# Altium schematic sheet DRIVER.SchDoc
size A3; SheetNumber: 3; SheetTotal: 4
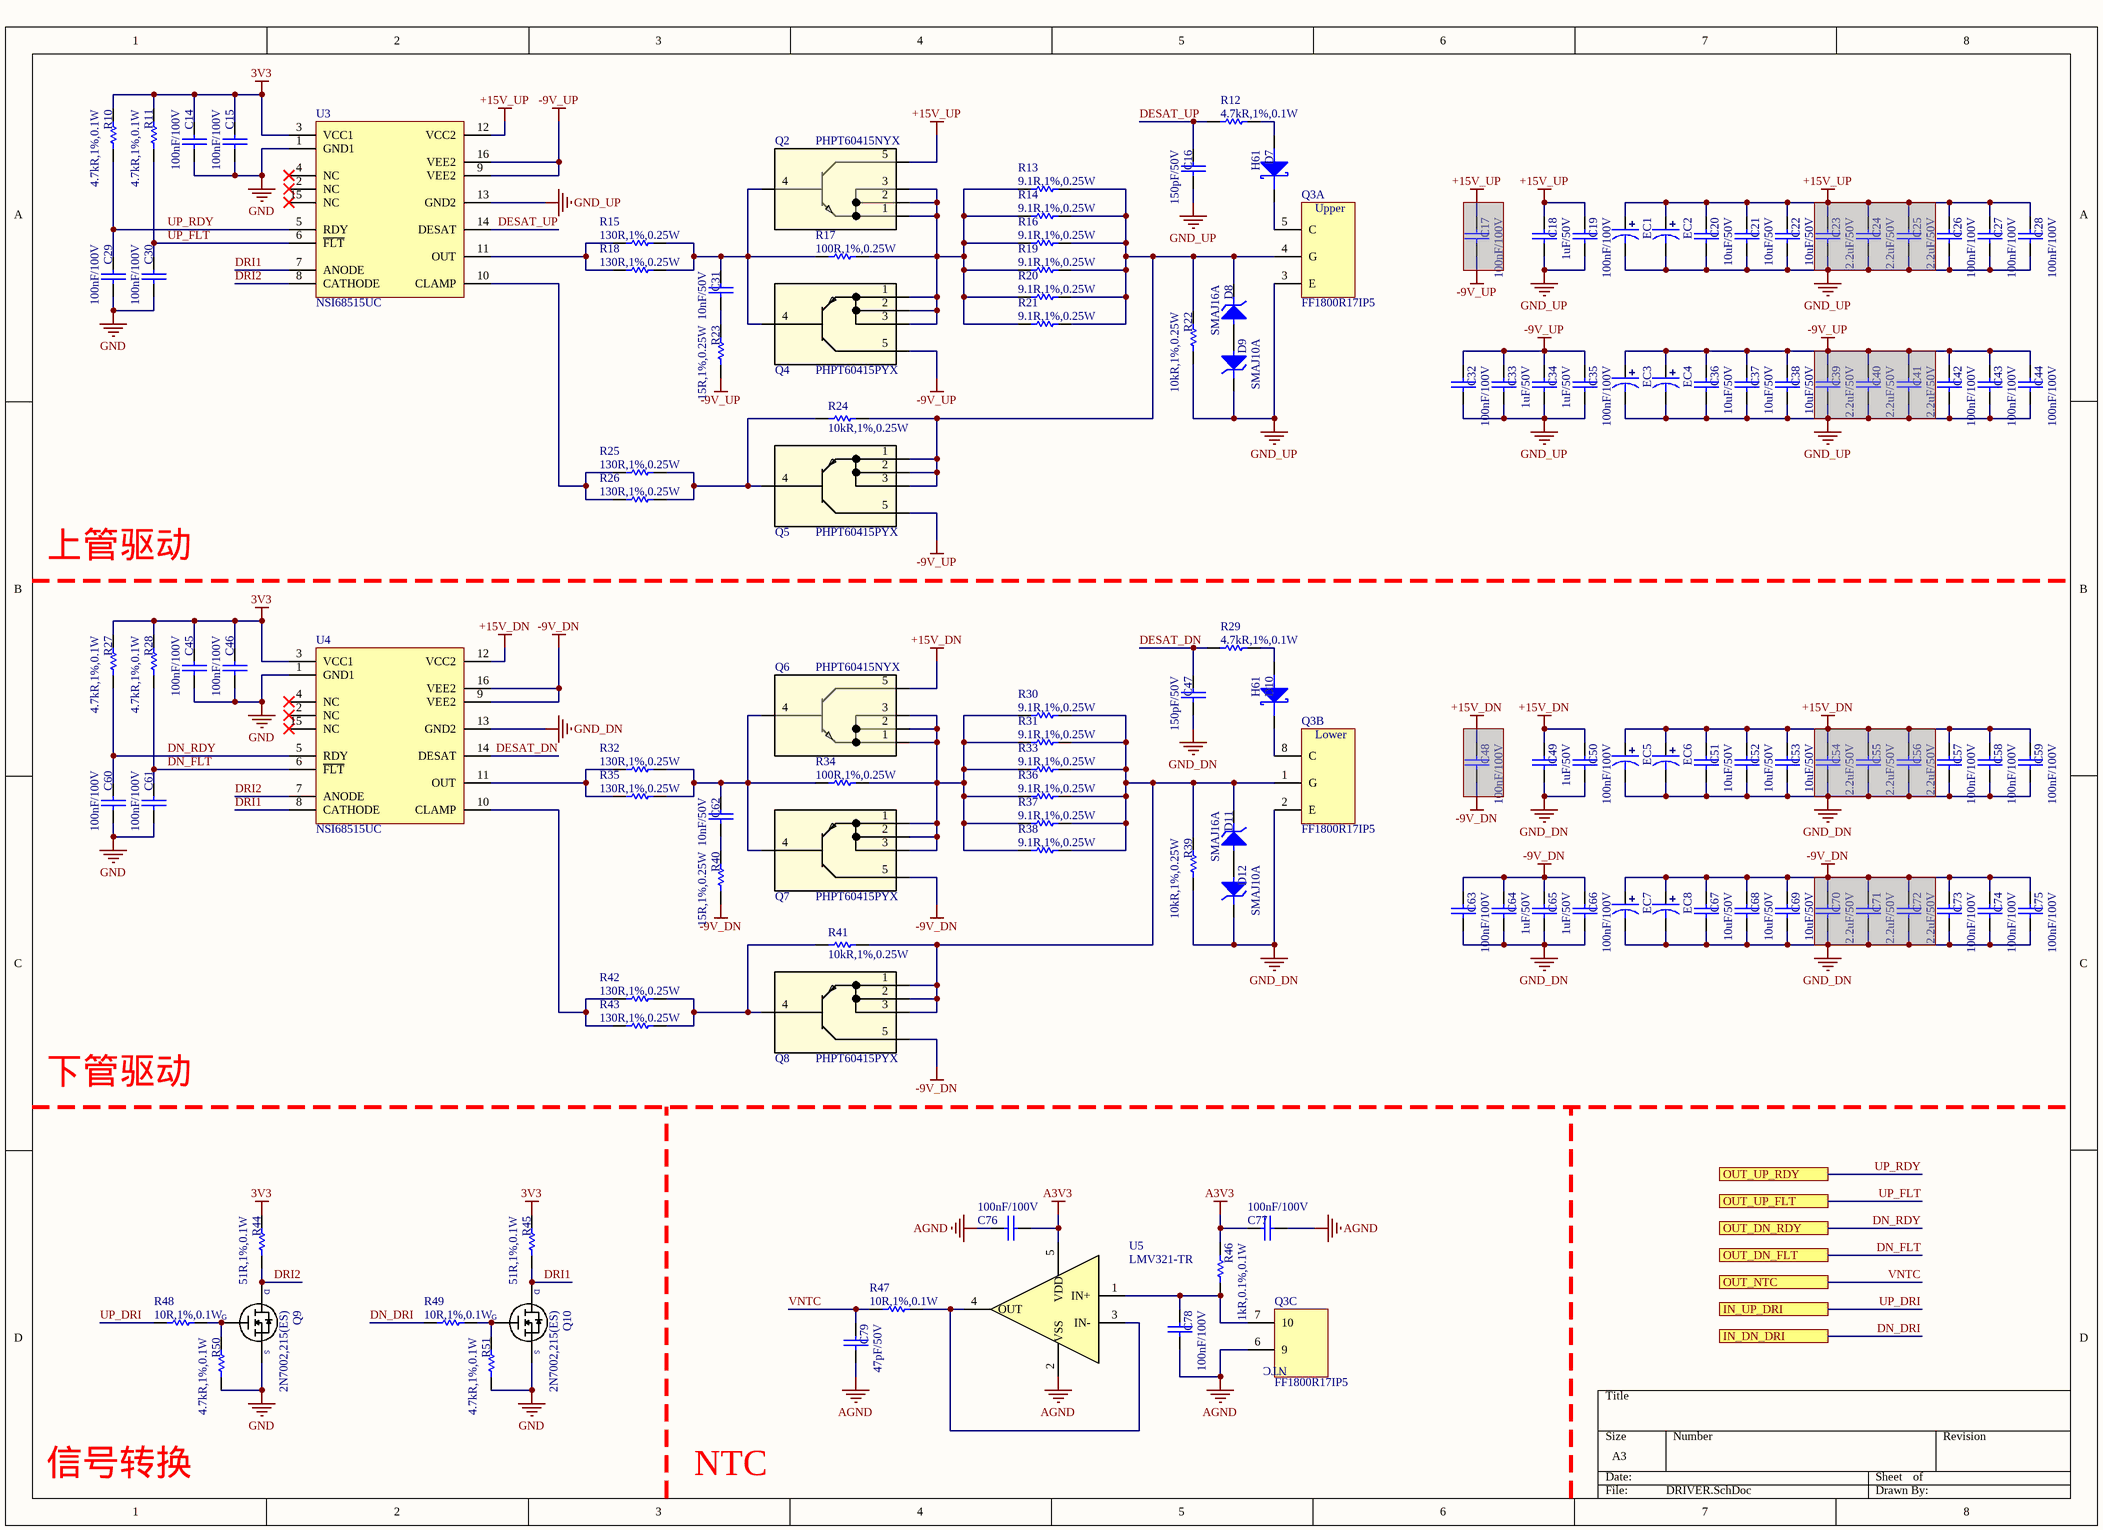
[diagram p0: DRIVER.SchDoc]

## Parts
C14  100nF/100V  [0603C]
C15  100nF/100V  [0603C]
C16  150pF/50V  [0603C]
C17  100nF/100V  [1206C]  (masked out: inside a compile mask, not in the netlist)
C18  1uF/50V  [0603C]
C19  100nF/100V  [0603C]
C20  10uF/50V  [1206C]
C21  10uF/50V  [1206C]
C22  10uF/50V  [1206C]
C23  2.2uF/50V  [1206C]  (masked out: inside a compile mask, not in the netlist)
C24  2.2uF/50V  [1206C]  (masked out: inside a compile mask, not in the netlist)
C25  2.2uF/50V  [1206C]  (masked out: inside a compile mask, not in the netlist)
C26  100nF/100V  [1206C]
C27  100nF/100V  [1206C]
C28  100nF/100V  [1206C]
C29  100nF/100V  [0603C]
C30  100nF/100V  [0603C]
C31  10nF/50V  [1206C]
C32  100nF/100V  [0603C]
C33  1uF/50V  [0603C]
C34  1uF/50V  [0603C]
C35  100nF/100V  [0603C]
C36  10uF/50V  [1206C]
C37  10uF/50V  [1206C]
C38  10uF/50V  [1206C]
C39  2.2uF/50V  [1206C]  (masked out: inside a compile mask, not in the netlist)
C40  2.2uF/50V  [1206C]  (masked out: inside a compile mask, not in the netlist)
C41  2.2uF/50V  [1206C]  (masked out: inside a compile mask, not in the netlist)
C42  100nF/100V  [1206C]
C43  100nF/100V  [1206C]
C44  100nF/100V  [1206C]
C45  100nF/100V  [0603C]
C46  100nF/100V  [0603C]
C47  150pF/50V  [0603C]
C48  100nF/100V  [1206C]  (masked out: inside a compile mask, not in the netlist)
C49  1uF/50V  [0603C]
C50  100nF/100V  [0603C]
C51  10uF/50V  [1206C]
C52  10uF/50V  [1206C]
C53  10uF/50V  [1206C]
C54  2.2uF/50V  [1206C]  (masked out: inside a compile mask, not in the netlist)
C55  2.2uF/50V  [1206C]  (masked out: inside a compile mask, not in the netlist)
C56  2.2uF/50V  [1206C]  (masked out: inside a compile mask, not in the netlist)
C57  100nF/100V  [1206C]
C58  100nF/100V  [1206C]
C59  100nF/100V  [1206C]
C60  100nF/100V  [0603C]
C61  100nF/100V  [0603C]
C62  10nF/50V  [1206C]
C63  100nF/100V  [0603C]
C64  1uF/50V  [0603C]
C65  1uF/50V  [0603C]
C66  100nF/100V  [0603C]
C67  10uF/50V  [1206C]
C68  10uF/50V  [1206C]
C69  10uF/50V  [1206C]
C70  2.2uF/50V  [1206C]  (masked out: inside a compile mask, not in the netlist)
C71  2.2uF/50V  [1206C]  (masked out: inside a compile mask, not in the netlist)
C72  2.2uF/50V  [1206C]  (masked out: inside a compile mask, not in the netlist)
C73  100nF/100V  [1206C]
C74  100nF/100V  [1206C]
C75  100nF/100V  [1206C]
C76  100nF/100V  [0603C]
C77  100nF/100V  [0603C]
C78  100nF/100V  [0603C]
C79  47pF/50V  [0603C]
D7  H61  [SOD-123]
D8  SMAJ16A  [SMA/DO-214AC]
D9  SMAJ10A  [SMA/DO-214AC]
D10  H61  [SOD-123]
D11  SMAJ16A  [SMA/DO-214AC]
D12  SMAJ10A  [SMA/DO-214AC]
EC1  MA25V470M8x10  [CAPAE830X1050L275X95N]  (value not drawn)
EC2  MA25V470M8x10  [CAPAE830X1050L275X95N]  (value not drawn)
EC3  MA25V470M8x10  [CAPAE830X1050L275X95N]  (value not drawn)
EC4  MA25V470M8x10  [CAPAE830X1050L275X95N]  (value not drawn)
EC5  MA25V470M8x10  [CAPAE830X1050L275X95N]  (value not drawn)
EC6  MA25V470M8x10  [CAPAE830X1050L275X95N]  (value not drawn)
EC7  MA25V470M8x10  [CAPAE830X1050L275X95N]  (value not drawn)
EC8  MA25V470M8x10  [CAPAE830X1050L275X95N]  (value not drawn)
Q2  PHPT60415NYX  [LFPAK56_SOT669_NEX]
Q3  FF1800R17IP5  [FF1800R17IP5]  (parts A,B,C of 3)
Q4  PHPT60415PYX  [LFPAK56_SOT669_NEX]
Q5  PHPT60415PYX  [LFPAK56_SOT669_NEX]
Q6  PHPT60415NYX  [LFPAK56_SOT669_NEX]
Q7  PHPT60415PYX  [LFPAK56_SOT669_NEX]
Q8  PHPT60415PYX  [LFPAK56_SOT669_NEX]
Q9  2N7002,215(ES)  [SOT23]
Q10  2N7002,215(ES)  [SOT23]
R10  4.7kR,1%,0.1W  [0603R]
R11  4.7kR,1%,0.1W  [0603R]
R12  4.7kR,1%,0.1W  [0603R]
R13  9.1R,1%,0.25W  [1206R]
R14  9.1R,1%,0.25W  [1206R]
R15  130R,1%,0.25W  [1206R]
R16  9.1R,1%,0.25W  [1206R]
R17  100R,1%,0.25W  [1206R]
R18  130R,1%,0.25W  [1206R]
R19  9.1R,1%,0.25W  [1206R]
R20  9.1R,1%,0.25W  [1206R]
R21  9.1R,1%,0.25W  [1206R]
R22  10kR,1%,0.25W  [1206R]
R23  15R,1%,0.25W  [1206R]
R24  10kR,1%,0.25W  [1206R]
R25  130R,1%,0.25W  [1206R]
R26  130R,1%,0.25W  [1206R]
R27  4.7kR,1%,0.1W  [0603R]
R28  4.7kR,1%,0.1W  [0603R]
R29  4.7kR,1%,0.1W  [0603R]
R30  9.1R,1%,0.25W  [1206R]
R31  9.1R,1%,0.25W  [1206R]
R32  130R,1%,0.25W  [1206R]
R33  9.1R,1%,0.25W  [1206R]
R34  100R,1%,0.25W  [1206R]
R35  130R,1%,0.25W  [1206R]
R36  9.1R,1%,0.25W  [1206R]
R37  9.1R,1%,0.25W  [1206R]
R38  9.1R,1%,0.25W  [1206R]
R39  10kR,1%,0.25W  [1206R]
R40  15R,1%,0.25W  [1206R]
R41  10kR,1%,0.25W  [1206R]
R42  130R,1%,0.25W  [1206R]
R43  130R,1%,0.25W  [1206R]
R44  51R,1%,0.1W  [0603R]
R45  51R,1%,0.1W  [0603R]
R46  1kR,0.1%,0.1W  [0603R]
R47  10R,1%,0.1W  [0603R]
R48  10R,1%,0.1W  [0603R]
R49  10R,1%,0.1W  [0603R]
R50  4.7kR,1%,0.1W  [0603R]
R51  4.7kR,1%,0.1W  [0603R]
U3  NSI68515UC  [SOIC16P127_1030X1030X265L70X39N]
U4  NSI68515UC  [SOIC16P127_1030X1030X265L70X39N]
U5  LMV321-TR  [SOT23-5P95_292X280X125L45X40N]

## Ports
IN_DN_DRI (see Top[2B]), IN_UP_DRI (see Top[2B]), OUT_DN_FLT (see Top[2B]), OUT_DN_RDY (see Top[2B]), OUT_NTC (see Top[2B]), OUT_UP_FLT (see Top[2A]), OUT_UP_RDY (see Top[2A])

## Nets
3V3: C14.1 C15.1 C45.1 C46.1 R10.2 R11.2 R27.2 R28.2 R44.1 R45.1 U3.3(VCC1) U4.3(VCC1)
+15V_DN: C49.2 C50.1 Q6.5(COLLECTOR) U4.12(VCC2)
+15V_UP: C18.2 C19.1 Q2.5(COLLECTOR) U3.12(VCC2)
-9V_DN: C63.1 C64.2 C65.2 C66.1 Q7.5(COLLECTOR) Q8.5(COLLECTOR) R40.1 U4.9(VEE2) U4.16(VEE2)
-9V_UP: C32.1 C33.2 C34.2 C35.1 Q4.5(COLLECTOR) Q5.5(COLLECTOR) R23.1 U3.9(VEE2) U3.16(VEE2)
A3V3: C76.2 C77.1 R46.2 U5.5(VDD)
AGND: C76.1 C77.2 C78.1 C79.1 Q3.6(9) U5.2(VSS)
GND: C14.2 C15.2 C29.1 C30.1 C45.2 C46.2 C60.1 C61.1 Q9.3 Q10.3 R50.1 R51.1 U3.1(GND1) U4.1(GND1)
GND_DN: C47.1 C49.1 C50.2 C63.2 C64.1 C65.1 C66.2 D12.K Q3.2(E) R39.1 U4.13(GND2)
GND_UP: C16.1 C18.1 C19.2 C32.2 C33.1 C34.1 C35.2 D9.K Q3.3(E) R22.1 U3.13(GND2)
DESAT_DN: C47.2 R29.2 U4.14(DESAT)
DESAT_UP: C16.2 R12.2 U3.14(DESAT)
DN_DRI: R49.2 ; port IN_DN_DRI
DN_FLT: C61.2 R28.1 U4.6(~{FLT}) ; port OUT_DN_FLT
DN_RDY: C60.2 R27.1 U4.5(RDY) ; port OUT_DN_RDY
DRI1: Q10.2 R45.2 U3.7(ANODE) U4.8(CATHODE)
DRI2: Q9.2 R44.2 U3.8(CATHODE) U4.7(ANODE)
UP_DRI: R48.2 ; port IN_UP_DRI
UP_FLT: C30.2 R11.1 U3.6(~{FLT}) ; port OUT_UP_FLT
UP_RDY: C29.2 R10.1 U3.5(RDY) ; port OUT_UP_RDY
VNTC: C79.2 R47.2 ; port OUT_NTC
NetC20_1: C20.1 C21.1 C22.1 C26.1 C27.1 C28.1 EC1.2 EC2.2
NetC20_2: C20.2 C21.2 C22.2 C26.2 C27.2 C28.2 EC1.1 EC2.1
NetC31_1: C31.1 R23.2
NetC31_2: C31.2 Q2.4(BASE) Q4.4(BASE) R15.2 R17.1 R18.2
NetC36_1: C36.1 C37.1 C38.1 C42.1 C43.1 C44.1 EC3.2 EC4.2
NetC36_2: C36.2 C37.2 C38.2 C42.2 C43.2 C44.2 EC3.1 EC4.1
NetC51_1: C51.1 C52.1 C53.1 C57.1 C58.1 C59.1 EC5.2 EC6.2
NetC51_2: C51.2 C52.2 C53.2 C57.2 C58.2 C59.2 EC5.1 EC6.1
NetC62_1: C62.1 R40.2
NetC62_2: C62.2 Q6.4(BASE) Q7.4(BASE) R32.2 R34.1 R35.2
NetC67_1: C67.1 C68.1 C69.1 C73.1 C74.1 C75.1 EC7.2 EC8.2
NetC67_2: C67.2 C68.2 C69.2 C73.2 C74.2 C75.2 EC7.1 EC8.1
NetC78_2: C78.2 Q3.7(10) R46.1 U5.1(IN+)
NetD7_A: D7.A R12.1
NetD7_K: D7.K Q3.5(C)
NetD8_A: D8.A D9.A
NetD8_K: D8.K Q3.4(G) Q5.1(EMITTER) Q5.2(EMITTER) Q5.3(EMITTER) R13.2 R14.2 R16.2 R19.2 R20.2 R21.2 R22.2 R24.1
NetD10_A: D10.A R29.1
NetD10_K: D10.K Q3.8(C)
NetD11_A: D11.A D12.A
NetD11_K: D11.K Q3.1(G) Q8.1(EMITTER) Q8.2(EMITTER) Q8.3(EMITTER) R30.2 R31.2 R33.2 R36.2 R37.2 R38.2 R39.2 R41.1
NetQ2_1: Q2.1(EMITTER) Q2.2(EMITTER) Q2.3(EMITTER) Q4.1(EMITTER) Q4.2(EMITTER) Q4.3(EMITTER) R13.1 R14.1 R16.1 R17.2 R19.1 R20.1 R21.1
NetQ5_4: Q5.4(BASE) R24.2 R25.2 R26.2
NetQ6_1: Q6.1(EMITTER) Q6.2(EMITTER) Q6.3(EMITTER) Q7.1(EMITTER) Q7.2(EMITTER) Q7.3(EMITTER) R30.1 R31.1 R33.1 R34.2 R36.1 R37.1 R38.1
NetQ8_4: Q8.4(BASE) R41.2 R42.2 R43.2
NetQ9_1: Q9.1 R48.1 R50.2
NetQ10_1: Q10.1 R49.1 R51.2
NetR15_1: R15.1 R18.1 U3.11(OUT)
NetR25_1: R25.1 R26.1 U3.10(CLAMP)
NetR32_1: R32.1 R35.1 U4.11(OUT)
NetR42_1: R42.1 R43.1 U4.10(CLAMP)
NetR47_1: R47.1 U5.3(IN-) U5.4(OUT)

Not connected (* = marked no-connect by the designer): U3 2(NC)* 4(NC)* 15(NC)*; U4 2(NC)* 4(NC)* 15(NC)*

## Notes on the sheet
- 上管驱动
- 下管驱动
- 信号转换
- NTC
- (in symbol FF1800R17IP5, part A) Upper
- (in symbol FF1800R17IP5, part B) Lower
- (in symbol FF1800R17IP5, part C) NTC
- (in symbol MOS-3P) D; G; S

## Library data of the parts
C14 C15 C19 C29 C30 C32 C35 C45 C46 C50 C60 C61 C63 C66 C76-C78 = CAP: CC0603KRX7R9BB104
C16 C47 = CAP: CC0603KRX7R9BB151
C17 C26-C28 C42-C44 C48 C57-C59 C73-C75 = CAP: CC1206KKX7R0BB104
C18 C33 C34 C49 C64 C65 = CAP: CC0603KRX7R9BB105
C20-C22 C36-C38 C51-C53 C67-C69 = CAP: CC1206KKX5R9BB106
C23-C25 C39-C41 C54-C56 C70-C72 = CAP: CC1206KKX7R9BB225
C31 C62 = CAP: CC1206KRX7R9BB103
C79 = CAP: CC0603FRNPO9BN470
D7 D10 = DIODE SCHOTTKY: 1.1V@1.0A，耐压1.6kV，trr=70ns
D8 D9 D11 D12 = TVS: 单向瞬态抑制二极管
EC1-EC8 = SMD_ECAP: 470uF@25V， Iripple = 4.1A
Q2 Q6 = PHPT60415NYX: No Description Available; Manufacturer_Name: Nexperia; Manufacturer_Part_Number: PHPT60410NYX; Type: Transistors; Copyright: Copyright (C) 2025 Ultra Librarian. All rights reserved.; RefDes: RefDes
Q3 = FF1800R17IP5: IGBT Module
Q4 Q5 Q7 Q8 = PHPT60415PYX: No Description Available; Manufacturer_Name: Nexperia; Type: Transistors; Copyright: Copyright (C) 2025 Ultra Librarian. All rights reserved.; Manufacturer_Part_Number: PHPT60415PYX; RefDes: RefDes
Q9 Q10 = MOS-3P
R10-R12 R27-R29 R47-R51 = RES: RC0603FR-074K7L
R13 R14 R16 R19-R21 R30 R31 R33 R36-R38 = RES: RC1206FR-079R1L
R15 R18 R25 R26 R32 R35 R42 R43 = RES: RC1206FR-07130RL
R17 R34 = RES: RC1206FR-07100RL
R22 R24 R39 R41 = RES: RC1206FR-0710KL
R23 R40 = RES: RC1206FR-0715RL
R44 R45 = RES: RC0603FR-0751RL
R46 = RES: RT0603BRD071KL
U3 U4 = NSI68515UC: Driver IC
U5 = LMV321-TR: 轨到轨运算放大器